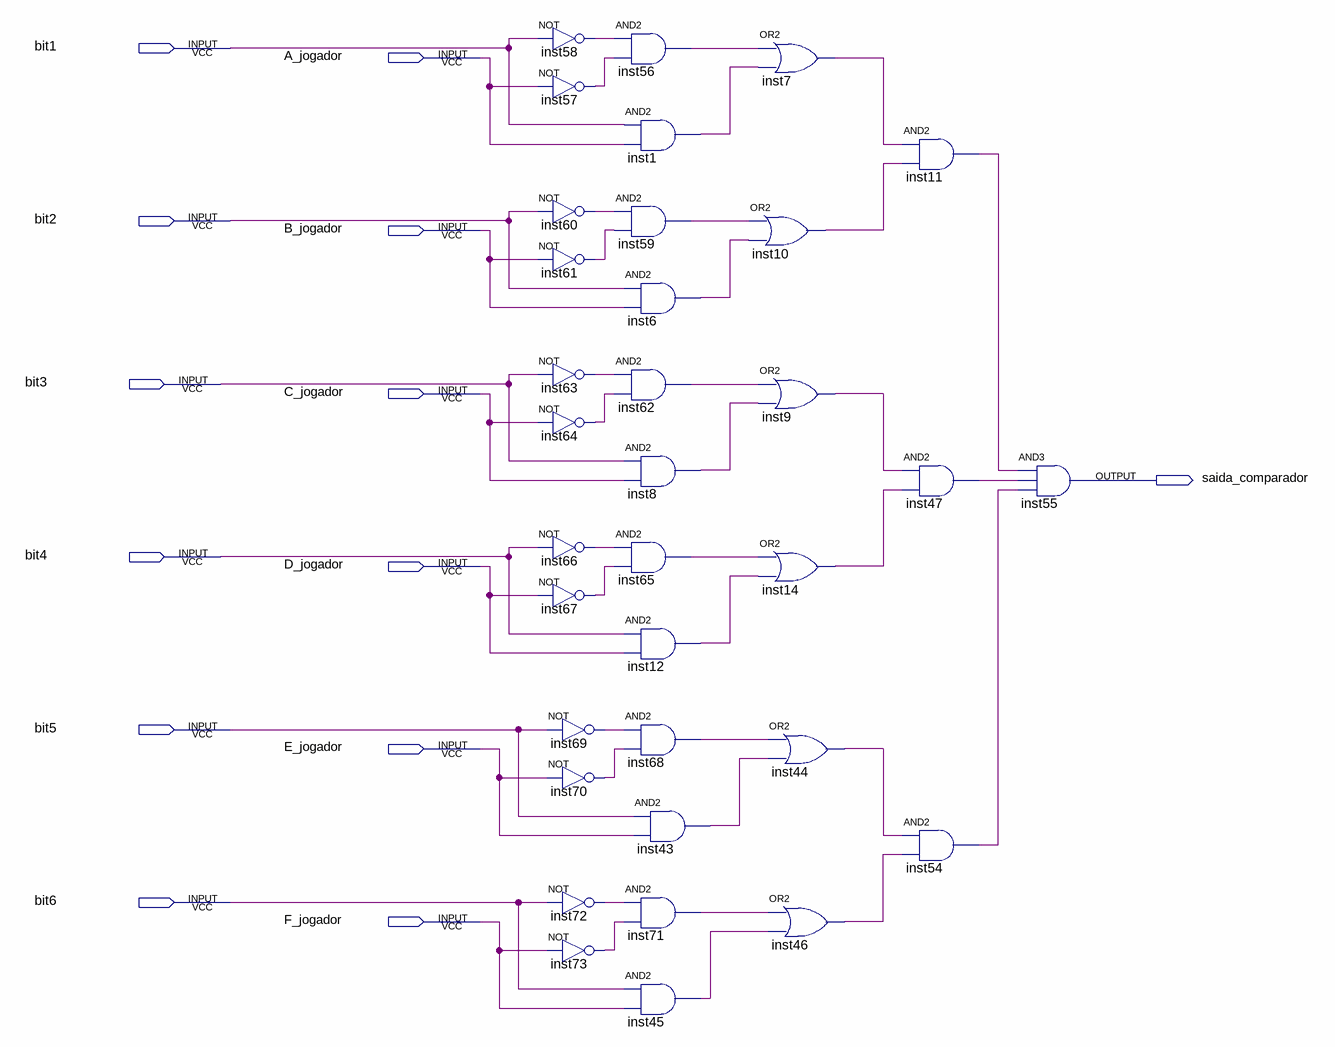
[diagram p0: schematic sheet]
// Quartus schematic comparador.bdf as structural Verilog: 34 symbols, 13 pins
module comparador (
  input  bit1,
  input  A_jogador,
  input  bit2,
  input  B_jogador,
  input  bit3,
  input  C_jogador,
  input  bit4,
  input  D_jogador,
  input  bit5,
  input  E_jogador,
  input  bit6,
  input  F_jogador,
  output saida_comparador
);

  wire inst1_out, inst6_out, inst7_out, inst8_out, inst9_out, inst10_out, inst11_out, inst12_out, inst14_out,
       inst43_out, inst44_out, inst45_out, inst46_out, inst47_out, inst54_out, inst56_out, inst57_out,
       inst58_out, inst59_out, inst60_out, inst61_out, inst62_out, inst63_out, inst64_out, inst65_out,
       inst66_out, inst67_out, inst68_out, inst69_out, inst70_out, inst71_out, inst72_out, inst73_out;

  not inst58 (inst58_out, bit1);
  not inst57 (inst57_out, A_jogador);
  not inst60 (inst60_out, bit2);
  not inst61 (inst61_out, B_jogador);
  not inst63 (inst63_out, bit3);
  not inst64 (inst64_out, C_jogador);
  not inst66 (inst66_out, bit4);
  not inst67 (inst67_out, D_jogador);
  not inst69 (inst69_out, bit5);
  not inst70 (inst70_out, E_jogador);
  not inst72 (inst72_out, bit6);
  not inst73 (inst73_out, F_jogador);
  and inst56 (inst56_out, inst58_out, inst57_out);
  and inst1 (inst1_out, bit1, A_jogador);
  and inst59 (inst59_out, inst60_out, inst61_out);
  and inst6 (inst6_out, bit2, B_jogador);
  and inst62 (inst62_out, inst63_out, inst64_out);
  and inst8 (inst8_out, bit3, C_jogador);
  and inst65 (inst65_out, inst66_out, inst67_out);
  and inst12 (inst12_out, bit4, D_jogador);
  and inst68 (inst68_out, inst69_out, inst70_out);
  and inst43 (inst43_out, bit5, E_jogador);
  and inst71 (inst71_out, inst72_out, inst73_out);
  and inst45 (inst45_out, bit6, F_jogador);
  or inst7 (inst7_out, inst56_out, inst1_out);
  or inst10 (inst10_out, inst59_out, inst6_out);
  or inst9 (inst9_out, inst62_out, inst8_out);
  or inst14 (inst14_out, inst65_out, inst12_out);
  or inst44 (inst44_out, inst68_out, inst43_out);
  or inst46 (inst46_out, inst71_out, inst45_out);
  and inst11 (inst11_out, inst7_out, inst10_out);
  and inst47 (inst47_out, inst9_out, inst14_out);
  and inst54 (inst54_out, inst44_out, inst46_out);
  and inst55 (saida_comparador, inst11_out, inst47_out, inst54_out);
endmodule
